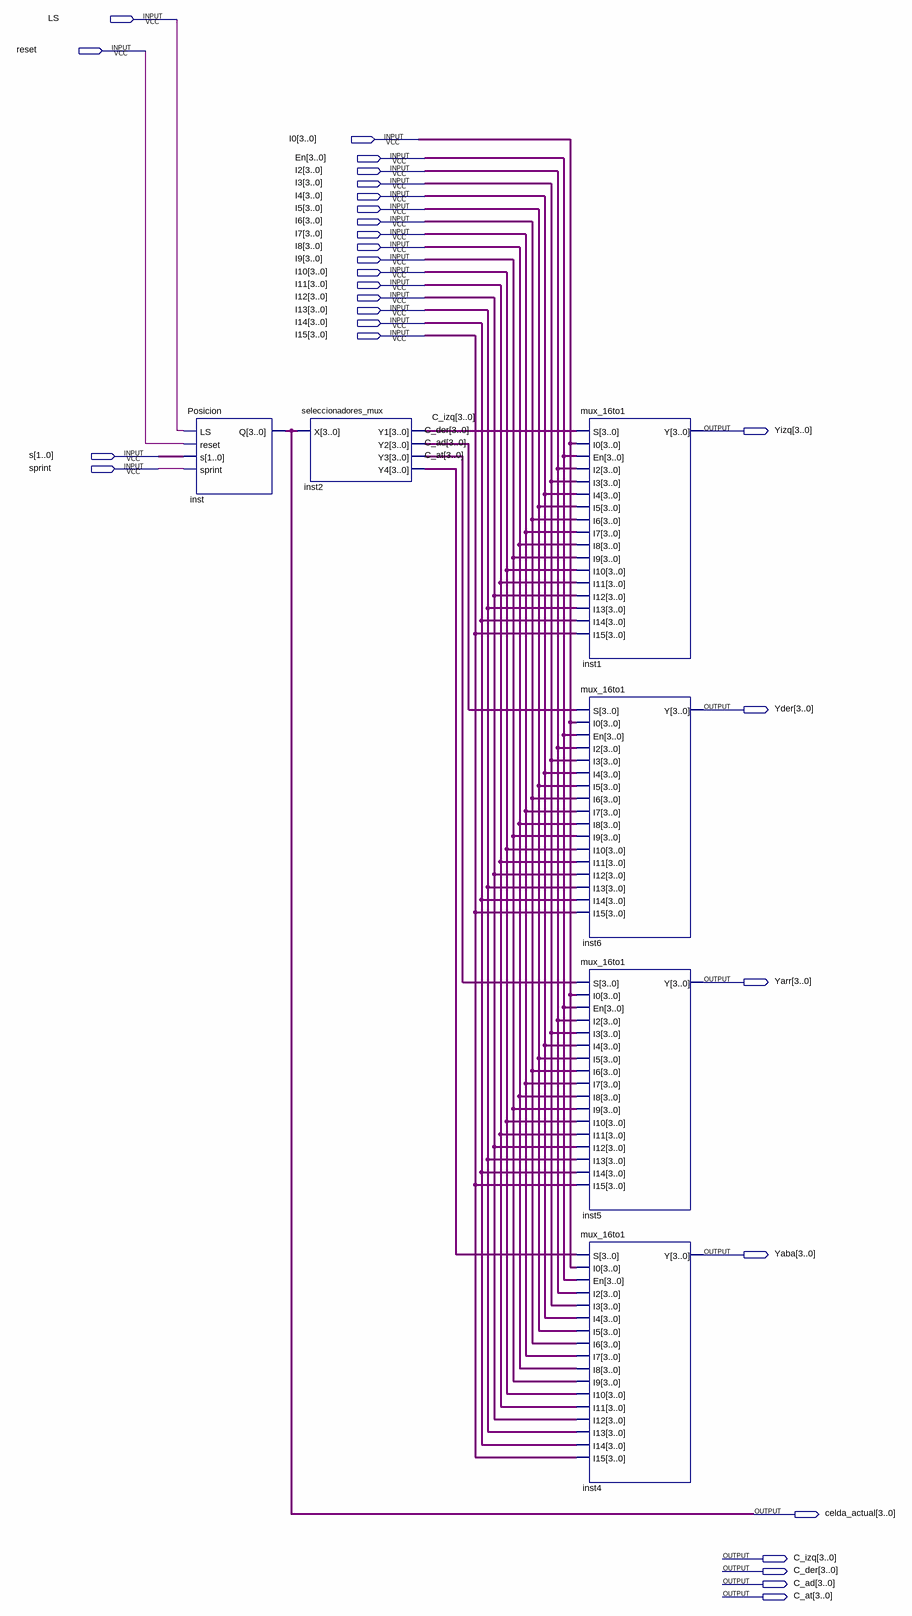
[diagram p0: schematic sheet]
// Quartus schematic Donde_ir.bdf as structural Verilog: 6 symbols, 29 pins
module Donde_ir (
  input  LS,
  input  reset,
  input  [3:0] I0,
  input  [3:0] En,
  input  [3:0] I2,
  input  [3:0] I3,
  input  [3:0] I4,
  input  [3:0] I5,
  input  [3:0] I6,
  input  [3:0] I7,
  input  [3:0] I8,
  input  [3:0] I9,
  input  [3:0] I10,
  input  [3:0] I11,
  input  [3:0] I12,
  input  [3:0] I13,
  input  [3:0] I14,
  input  [3:0] I15,
  input  [1:0] s,
  input  sprint,
  output [3:0] Yizq,
  output [3:0] Yder,
  output [3:0] Yarr,
  output [3:0] Yaba,
  output [3:0] celda_actual,
  output [3:0] C_izq,
  output [3:0] C_der,
  output [3:0] C_ad,
  output [3:0] C_at
);

  Posicion inst (.LS(LS), .reset(reset), .s(s), .sprint(sprint), .Q(celda_actual));
  seleccionadores_mux inst2 (.X(celda_actual), .Y1(C_izq), .Y2(C_der), .Y3(C_ad), .Y4(C_at));
  mux_16to1 inst1 (
    .S(C_izq), .I0(I0), .En(En), .I2(I2), .I3(I3), .I4(I4), .I5(I5), .I6(I6), .I7(I7), .I8(I8), .I9(I9),
    .I10(I10), .I11(I11), .I12(I12), .I13(I13), .I14(I14), .I15(I15), .Y(Yizq));
  mux_16to1 inst6 (
    .S(C_der), .I0(I0), .En(En), .I2(I2), .I3(I3), .I4(I4), .I5(I5), .I6(I6), .I7(I7), .I8(I8), .I9(I9),
    .I10(I10), .I11(I11), .I12(I12), .I13(I13), .I14(I14), .I15(I15), .Y(Yder));
  mux_16to1 inst5 (
    .S(C_ad), .I0(I0), .En(En), .I2(I2), .I3(I3), .I4(I4), .I5(I5), .I6(I6), .I7(I7), .I8(I8), .I9(I9),
    .I10(I10), .I11(I11), .I12(I12), .I13(I13), .I14(I14), .I15(I15), .Y(Yarr));
  mux_16to1 inst4 (
    .S(C_at), .I0(I0), .En(En), .I2(I2), .I3(I3), .I4(I4), .I5(I5), .I6(I6), .I7(I7), .I8(I8), .I9(I9),
    .I10(I10), .I11(I11), .I12(I12), .I13(I13), .I14(I14), .I15(I15), .Y(Yaba));
endmodule
